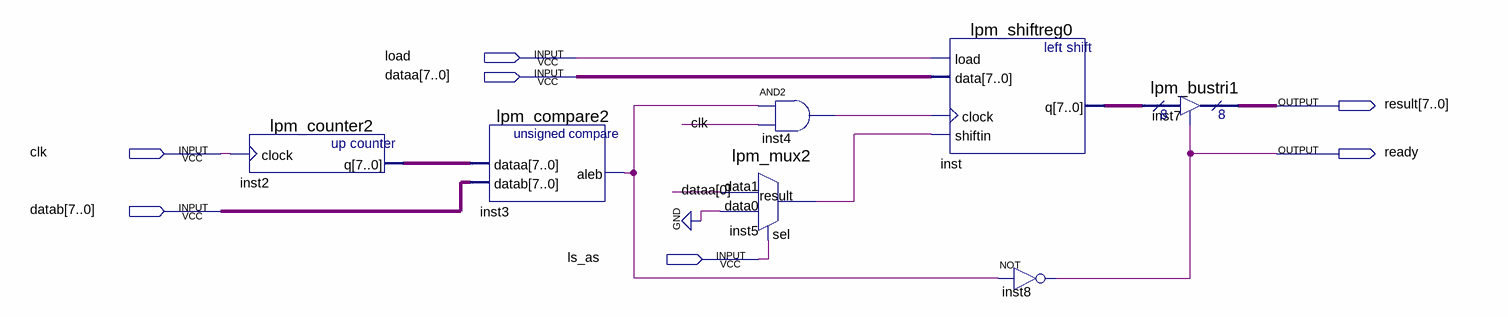
[diagram p0: schematic sheet]
// Quartus schematic WN_left_shift.bdf as structural Verilog: 7 symbols, 7 pins
module WN_left_shift (
  input  load,
  input  [7:0] dataa,
  input  clk,
  input  [7:0] datab,
  input  ls_as,
  output [7:0] result,
  output ready
);

  wire inst3_aleb, inst4_out, inst5_result;
  wire [7:0] inst2_q, inst_q;

  lpm_counter2 inst2 (.clock(clk), .q(inst2_q));
  lpm_compare2 inst3 (.dataa(inst2_q), .datab(datab), .aleb(inst3_aleb));
  and inst4 (inst4_out, inst3_aleb, clk);
  lpm_mux2 inst5 (.data1(dataa[0]), .data0(1'b0), .sel(ls_as), .result(inst5_result));
  lpm_shiftreg0 inst (.load(load), .data(dataa), .clock(inst4_out), .shiftin(inst5_result), .q(inst_q));
  not inst8 (ready, inst3_aleb);
  lpm_bustri1 inst7 (.enabledt(ready), .data(inst_q), .tridata(result));
endmodule
